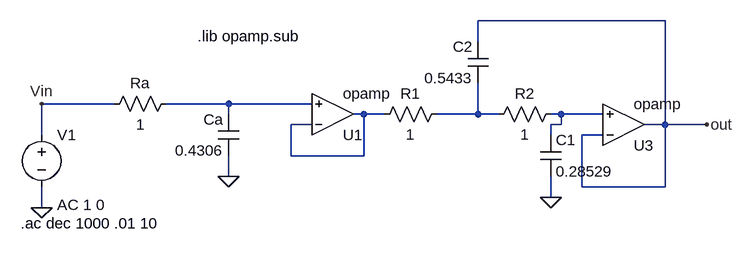
[diagram p0: schematic 26TS_4_sintesis_normalizada.asc]
26TS_4_sintesis_normalizada.asc, the LTspice schematic file:
Version 4.1
SHEET 1 1396 680
WIRE 768 -48 480 -48
WIRE 480 -16 480 -48
WIRE -80 80 -192 80
WIRE 96 80 0 80
WIRE 224 80 96 80
WIRE 96 96 96 80
WIRE 304 96 288 96
WIRE 336 96 304 96
WIRE 480 96 480 48
WIRE 480 96 416 96
WIRE 512 96 480 96
WIRE 608 96 592 96
WIRE 672 96 608 96
WIRE 224 112 192 112
WIRE 608 112 608 96
WIRE 608 112 592 112
WIRE 768 112 768 -48
WIRE 768 112 736 112
WIRE 832 112 768 112
WIRE -192 128 -192 80
WIRE 592 128 592 112
WIRE 672 128 640 128
WIRE 192 160 192 112
WIRE 304 160 304 96
WIRE 304 160 192 160
WIRE 96 192 96 160
WIRE 640 208 640 128
WIRE 768 208 768 112
WIRE 768 208 640 208
WIRE 592 224 592 192
WIRE -192 240 -192 208
FLAG 96 192 0
FLAG -192 240 0
FLAG -192 80 Vin
FLAG 832 112 out
FLAG 592 224 0
SYMBOL cap 112 160 R180
WINDOW 0 24 56 Left 2
WINDOW 3 24 8 Left 2
SYMATTR InstName Ca
SYMATTR Value 0.4306
SYMBOL res -96 96 R270
WINDOW 0 32 56 VTop 2
WINDOW 3 0 56 VBottom 2
SYMATTR InstName Ra
SYMATTR Value 1
SYMBOL voltage -192 112 R0
WINDOW 123 24 124 Left 2
WINDOW 39 0 0 Left 0
SYMATTR Value2 AC 1 0
SYMATTR InstName V1
SYMATTR Value ""
SYMBOL OpAmps\\opamp 704 176 M180
SYMATTR InstName U3
SYMBOL cap 496 48 R180
WINDOW 0 24 56 Left 2
WINDOW 3 24 8 Left 2
SYMATTR InstName C2
SYMATTR Value 0.5433
SYMBOL res 432 80 R90
WINDOW 0 0 56 VBottom 2
WINDOW 3 32 56 VTop 2
SYMATTR InstName R1
SYMATTR Value 1
SYMBOL res 608 80 R90
WINDOW 0 0 56 VBottom 2
WINDOW 3 32 56 VTop 2
SYMATTR InstName R2
SYMATTR Value 1
SYMBOL cap 576 128 R0
SYMATTR InstName C1
SYMATTR Value 0.28529
SYMBOL OpAmps\\opamp 256 160 M180
SYMATTR InstName U1
TEXT -224 264 Left 2 !.ac dec 1000 .01 10
TEXT 48 -24 Left 2 !.lib opamp.sub

The netlist it stands for:
* 26TS_4_sintesis_normalizada.asc
Ca 0 N001 0.4306
Ra Vin N001 1
V1 Vin 0 AC 1 0
X§U3 out N004 out opamp Aol=100K GBW=10Meg  ; pins invin noninvin out
C2 N003 out 0.5433
R1 N003 N002 1
R2 N004 N003 1
C1 N004 0 0.28529
X§U1 N002 N001 N002 opamp Aol=100K GBW=10Meg  ; pins invin noninvin out
.ac dec 1000 .01 10
.lib opamp.sub
.backanno
.end